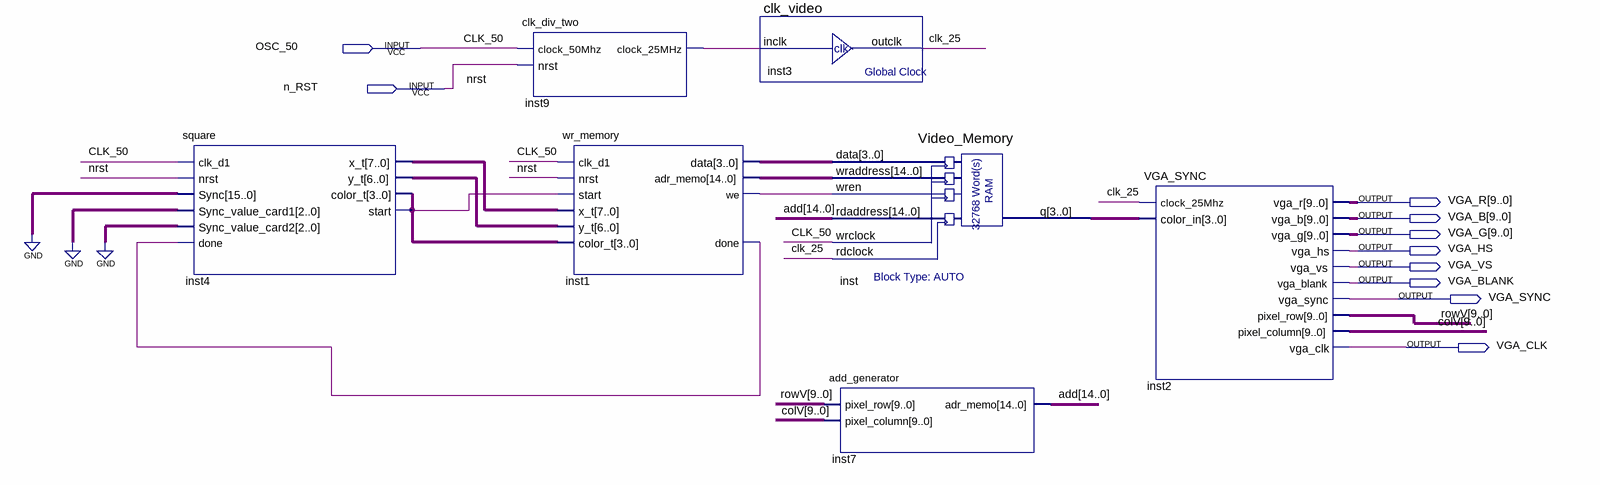
[diagram p0: schematic sheet]
// Quartus schematic VGA_visualisation.bdf as structural Verilog: 7 symbols, 10 pins
module VGA_visualisation (
  input  OSC_50,
  input  n_RST,
  output [9:0] VGA_R,
  output [9:0] VGA_B,
  output [9:0] VGA_G,
  output VGA_HS,
  output VGA_VS,
  output VGA_BLANK,
  output VGA_SYNC,
  output VGA_CLK
);

  wire clk_25, inst1_done, inst1_we, inst9_clock_25mhz, undriven;
  wire [3:0] inst1_data, inst4_color_t, inst_q;
  wire [6:0] inst4_y_t;
  wire [7:0] inst4_x_t;
  wire [9:0] colV, rowV;
  wire [14:0] add, inst1_adr_memo;

  square inst4 (
    .clk_d1(OSC_50), .nrst(n_RST), .Sync({16{1'b0}}), .Sync_value_card1(3'b000), .Sync_value_card2(3'b000),
    .done(inst1_done), .x_t(inst4_x_t), .y_t(inst4_y_t), .color_t(inst4_color_t), .start(inst4_color_t));
  clk_div_two inst9 (.clock_50Mhz(OSC_50), .nrst(n_RST), .clock_25MHz(inst9_clock_25mhz));
  wr_memory inst1 (
    .clk_d1(OSC_50), .start(undriven), .nrst(n_RST), .x_t(inst4_x_t), .y_t(inst4_y_t),
    .color_t(inst4_color_t), .we(inst1_we), .done(inst1_done), .data(inst1_data), .adr_memo(inst1_adr_memo));
  clk_video inst3 (.inclk(inst9_clock_25mhz), .outclk(clk_25));
  Video_Memory inst (
    .data(inst1_data), .wraddress(inst1_adr_memo), .wren(inst1_we), .rdaddress(add), .wrclock(OSC_50),
    .rdclock(clk_25), .q(inst_q));
  add_generator inst7 (.pixel_row(rowV), .pixel_column(colV), .adr_memo(add));
  VGA_SYNC inst2 (
    .clock_25Mhz(clk_25), .color_in(inst_q), .vga_r(VGA_R), .vga_b(VGA_B), .vga_g(VGA_G), .vga_hs(VGA_HS),
    .vga_vs(VGA_VS), .vga_blank(VGA_BLANK), .vga_sync(VGA_SYNC), .pixel_row(rowV), .pixel_column(colV),
    .vga_clk(VGA_CLK));

  // Other names for the same wires on the sheet: CLK_50 = OSC_50; nrst = n_RST
endmodule
